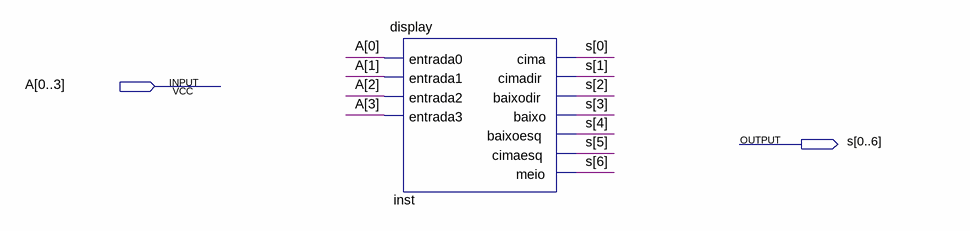
[diagram p0: schematic sheet]
// Quartus schematic numberToDisplay.bdf as structural Verilog: 1 symbols, 2 pins
module numberToDisplay (
  input  [0:3] A,
  output [0:6] s
);

  display inst (
    .entrada0(A[0]), .entrada1(A[1]), .entrada2(A[2]), .entrada3(A[3]), .cima(s[0]), .cimadir(s[1]),
    .baixodir(s[2]), .baixo(s[3]), .baixoesq(s[4]), .cimaesq(s[5]), .meio(s[6]));
endmodule
